# EAGLE design ws2812-Breakout (EAGLE 6.4)
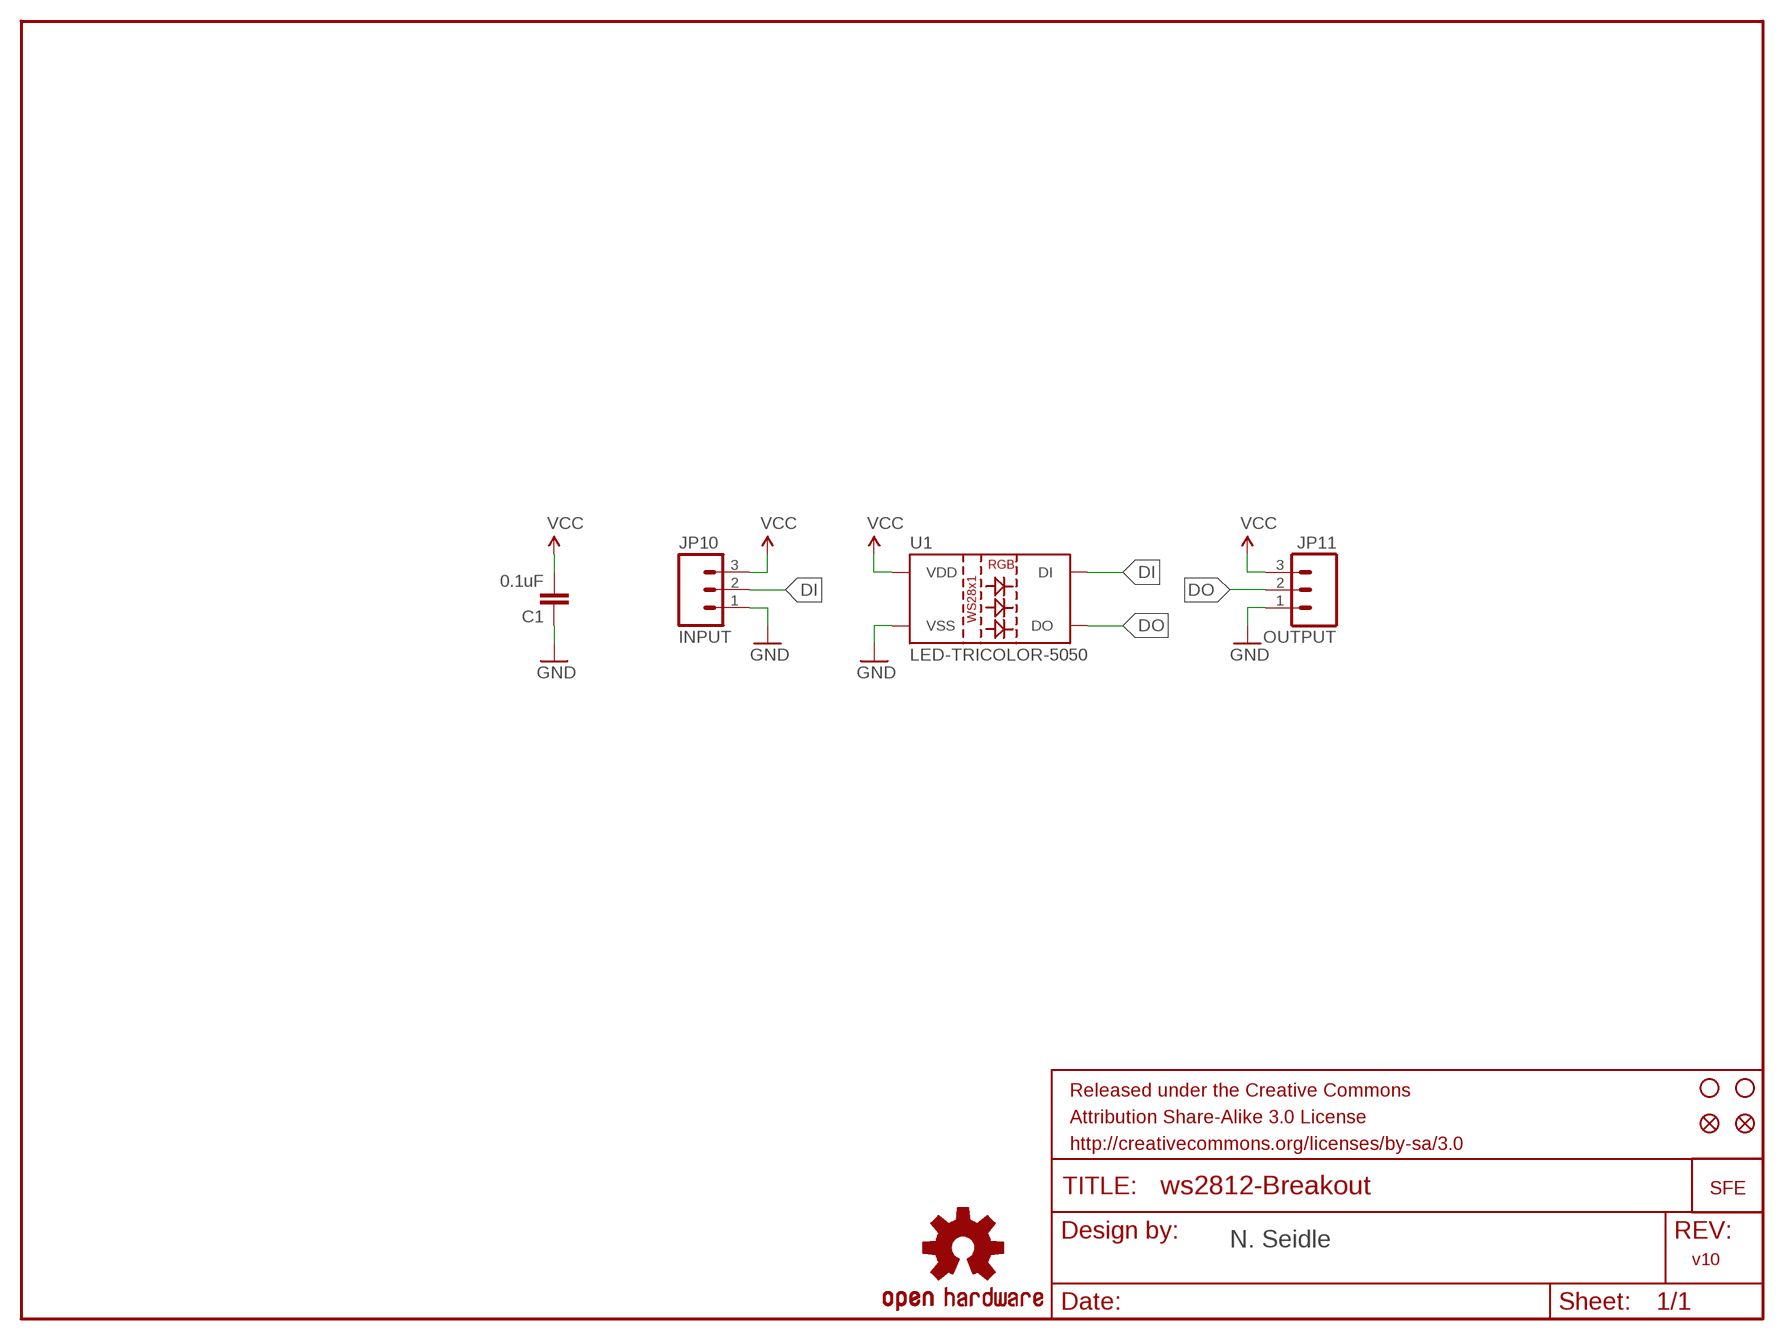
[diagram p0: schematic, sheet 1]

## Parts
C1  0.1uF  CAP0603-CAP  [0603-CAP]
FID1  FIDUCIALUFIDUCIAL  [MICRO-FIDUCIAL]
FID2  FIDUCIALUFIDUCIAL  [MICRO-FIDUCIAL]
FRAME1  FRAME-LETTER  [CREATIVE_COMMONS]
JP1  STAND-OFF  [STAND-OFF]
JP3  LOGO-SFESK  [SFE-LOGO-FLAME]
JP4  STAND-OFF  [STAND-OFF]
JP10  INPUT  M03PTH  [1X03]
JP11  OUTPUT  M03PTH  [1X03]
LOGO1  OSHW-LOGOS  [OSHW-LOGO-S]
U1  LED-TRICOLOR-5050  LED-TRICOLOR-5050-ICWS2811  [LED-TRICOLOR-5050-IC]

## Nets
DI: JP10.2 U1.2(DI)
DO: JP11.2 U1.1(DO)
GND: C1.1 JP10.1 JP11.1 U1.6(VSS)
VCC: C1.2 JP10.3 JP11.3 U1.3(VDD) U1.5(VDD)

## Notes on the sheet
- N. Seidle
- v10

## Library data of the parts
C1 = SparkFun:CAP: Capacitor Standard 0603 ceramic capacitor, and 0.1" leaded capacitor.
FID1 FID2 = SparkFun-Aesthetics:FIDUCIAL: Fiducial Alignment Points Various fiducial points for machine vision alignment.
FRAME1 = SparkFun-Aesthetics:FRAME-LETTER: Schematic Frame Standard 8.5x11 US Letter frame
JP1 JP4 = SparkFun:STAND-OFF: Stand Off This is the mechanical footprint for a #4 phillips button head screw. Use the keepout ring to avoid running the screw head into surrounding components. SKU : PRT-00447
JP3 = SparkFun:LOGO-SFE: Spark Fun Electronics PCB Logo This is the standard Spark Fun Electronics PCB logo.
JP10 JP11 = SparkFun-Connectors:M03: Header 3 Standard 3-pin 0.1" header. Use with straight break away headers (SKU : PRT-00116), right angle break away headers (PRT-00553), swiss pins (PRT-00743), machine pins (PRT-00117), and female headers (PRT-00115). Molex polarized connector foot print use with SKU : PRT-08232 with associated crimp pins and housings.
LOGO1 = SparkFun-Aesthetics:OSHW-LOGO: Open Source Hardware Logo This logo indicates the piece of hardware it is found on incorporates a OSHW license and/or adheres to the definition of open source hardware found here: http://freedomdefined.org/OSHW
U1 = SparkFun-LED:LED-TRICOLOR-5050-IC: 5x5mm SMD LED with built-in controller IC.

## Board
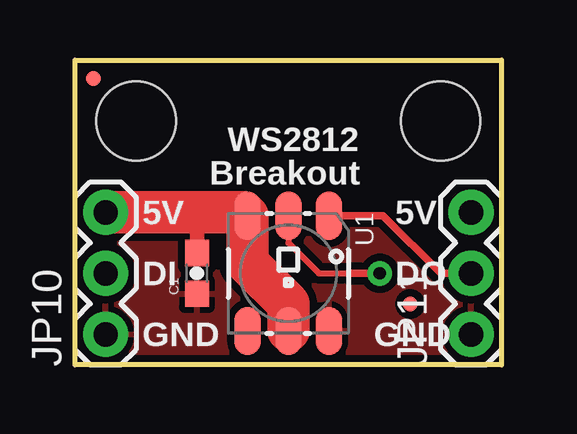
[diagram p1: board, top side]
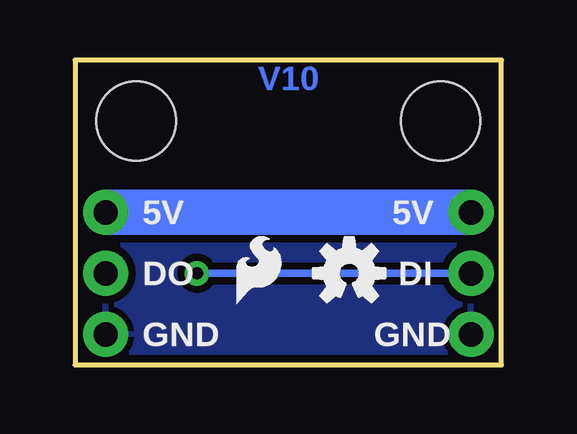
[diagram p2: board, bottom side, seen from below]

Size 17.78 x 12.7 mm. Coordinates in mm from the lower left corner, seen from the top.
Outline: 0,0 0,12.7 17.78,12.7 17.78,0 0,0
Copper layers (1*16): Top 0.035mm / dielectric 1.5mm / Bottom 0.035mm
Design rules "SparkFun": minimum track width 8mil, minimum drill 20mil, track to track 8mil, track to pad 8mil, pad to pad 8mil, via to via 8mil, smd to smd 8mil, copper to edge 10mil, drill to drill 8mil, minimum pad ring 12mil, minimum via ring 10mil, stop-mask expansion 4mil, vias tented up to drill 25mil, thermal gap 10mil

### Footprints (pad centres in the part's own frame; a part is rotated, then mirrored left to right if it is on the bottom)
0603-CAP = smd 1.1 x 1: 1 -0.85,0; 2 0.85,0
MICRO-FIDUCIAL = smd 0.635 x 0.635: 1 0,0
STAND-OFF = hole 3.302: 0,0
1X03 = drill 1.016 pad 1.88: 1 0,0; 2 2.54,0; 3 5.08,0
LED-TRICOLOR-5050-IC = smd 2 x 1.1: 1 -2.4,1.7; 2 -2.4,0; 3 -2.4,-1.7; 4 2.4,-1.7; 5 2.4,0; 6 2.4,1.7

### Placement (x,y rotation side)
C1  5.08,3.81 90 top
FID1  0.76,11.94 0 top
FID2  13.97,2.54 0 top
FRAME1  -15.1,-17.78 0 top  (outside the outline)
JP1  15.24,10.16 0 top
JP3  11.05,2.54 0 bottom
JP4  2.54,10.16 0 top
JP10  1.27,1.27 90 top
JP11  16.51,1.27 90 top
LOGO1  6.35,3.81 0 bottom
U1  8.89,3.81 270 top

### Tracks (layer width: path | path; a pad name or v marks a point on that pad's centre or on a via)
DI  (via drill 0.51)
  Top 0.254: U1.2 8.89,5.08 10.16,3.81 11.43,3.81
  Top 0.305: 11.43,3.81 v12.7,3.81
  Bottom 0.305: v12.7,3.81 JP10.2
DO
  Top 0.305: U1.1 12.84,6.21 15.24,3.81 JP11.2
GND
  pour Top (isolate 0.305): 0,7.62 0,0 17.78,0 17.78,7.62
  pour Bottom (isolate 0.305): 0,7.62 0,0 17.78,0 17.78,7.62
VCC
  Top 0.254: 7.11,6.35 U1.3
  Top 0.61: C1.2 5.08,6.35
  Top 1.778: JP10.3 5.08,6.35 6.35,6.35 | 6.35,6.35 7.05,6.35 | U1.5 8.89,2.54 7.19,4.24 U1.3 6.35,6.35
  Bottom 1.905: JP11.3 JP10.3

### Text on the board
Bottom: V10
tPlace: WS2812 | Breakout | 5V | 5V | DI | DO | GND | GND
bPlace: 5V | 5V | DI | DO | GND | GND
Document: N. Seidle